# EAGLE schematic tip41c-li-iron-charger-v0 (EAGLE 5.07)
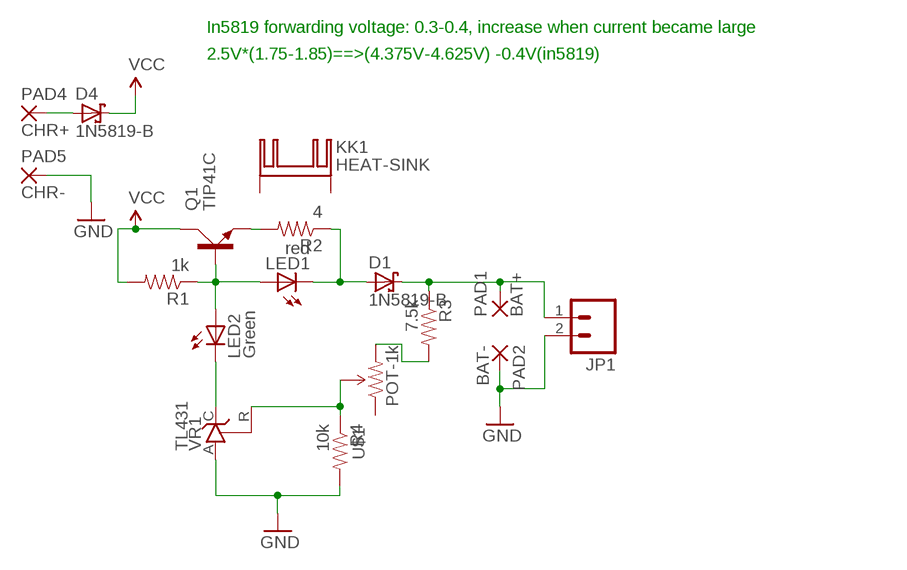
[diagram p0: schematic, sheet 1]

## Parts
D1  1N5819-B  [DO41-7.6]
D4  1N5819-B  [DO41-7.6]
JP1  M02LOCK_LONGPADS  [1X02_LOCK_LONGPADS]
KK1  HEAT-SINK  [DTOY-HEATSINK-24MMX16MM]
LED1  red  LED3MM  [LED3MM]
LED2  Green  LED3MM  [LED3MM]
PAD1  BAT+  WIREPAD3,17/1,1  [3,17/1,1]
PAD2  BAT-  WIREPAD3,17/1,1  [3,17/1,1]
PAD4  CHR+  WIREPAD3,17/1,1  [3,17/1,1]
PAD5  CHR-  WIREPAD3,17/1,1  [3,17/1,1]
Q1  TIP41C  [TO220AV]
R1  1k  RESISTOR  [0805]
R2  4  RESISTOR1/4W  [AXIAL-0.3]
R3  7.5k  RESISTOR  [0805]
R4  10k  RESISTOR  [0805]
U$1  POT-1k  TRIMPOTPTH  [TRIM_POT_PTH]
VR1  TL431  TL431RAC  [TO92-RAC]

## Nets
GND: JP1.2 PAD2.1(P) PAD5.1(P) R4.2 VR1.A
N$1: Q1.E R2.P$2
N$2: LED2.K(C) VR1.C
N$3: LED1.A LED2.A Q1.B R1.1
N$4: D1.A LED1.K(C) R2.P$1
N$5: R4.1 U$1.2(WIPER) VR1.R
N$6: R3.2 U$1.3(CW)
N$7: D1.C JP1.1 PAD1.1(P) R3.1
N$13: D4.A PAD4.1(P)
VCC: D4.C Q1.C R1.2
Unconnected: KK1.A2,2(K) KK1.B2,2(K) U$1.1(CCW)

## Notes on the sheet
- In5819 forwarding voltage: 0.3-0.4, increase when current became large
- 2.5V*(1.75-1.85)==>(4.375V-4.625V) -0.4V(in5819)

## Library data of the parts
D1 D4 = digital-toy:1N581*: 1.0A SCHOTTKY BARRIER RECTIFIER Source: http://www.diodes.com/datasheets/ds23001.pdf
JP1 = SparkFun:M02: Header 2 Standard 2-pin 0.1" header. Use with straight break away headers (SKU : PRT-00116), right angle break away headers (PRT-00553), swiss pins (PRT-00743), machine pins (PRT-00117), and female headers (PRT-00115). Molex polarized connector foot print use with SKU : PRT-08233 with associated crimp pins and housings.
KK1 = digital-toy:HEAT-SINK: HEATSINK manufacturer Fischer/distributor Buerklin digital-toy 24.92x 16.05, hole:18.93mm, dimeter:1.28mm
LED1 LED2 = digital-toy:LED: LEDs Standard schematic elements and footprints for 5mm, 3mm, 1206, and 0603 sized LEDs. 5mm - Spark Fun Electronics SKU : COM-00529 (and others)
PAD1 PAD2 PAD4 PAD5 = wirepad:WIREPAD: Wire PAD connect wire on PCB
Q1 = transistor-power:TIP41C: NPN TRANSISTOR
R1-R4 = digital-toy:RESISTOR: Resistor Basic schematic elements and footprints for 0603, 1206, and PTH 1/10th watt (small) resistors.
U$1 = SparkFun:TRIMPOT
VR1 = digital-toy:TL431: VOLTAGE REGULATOR